# EAGLE design ardio_st32f205 (EAGLE 5.11)

## Sheet 1 of 3
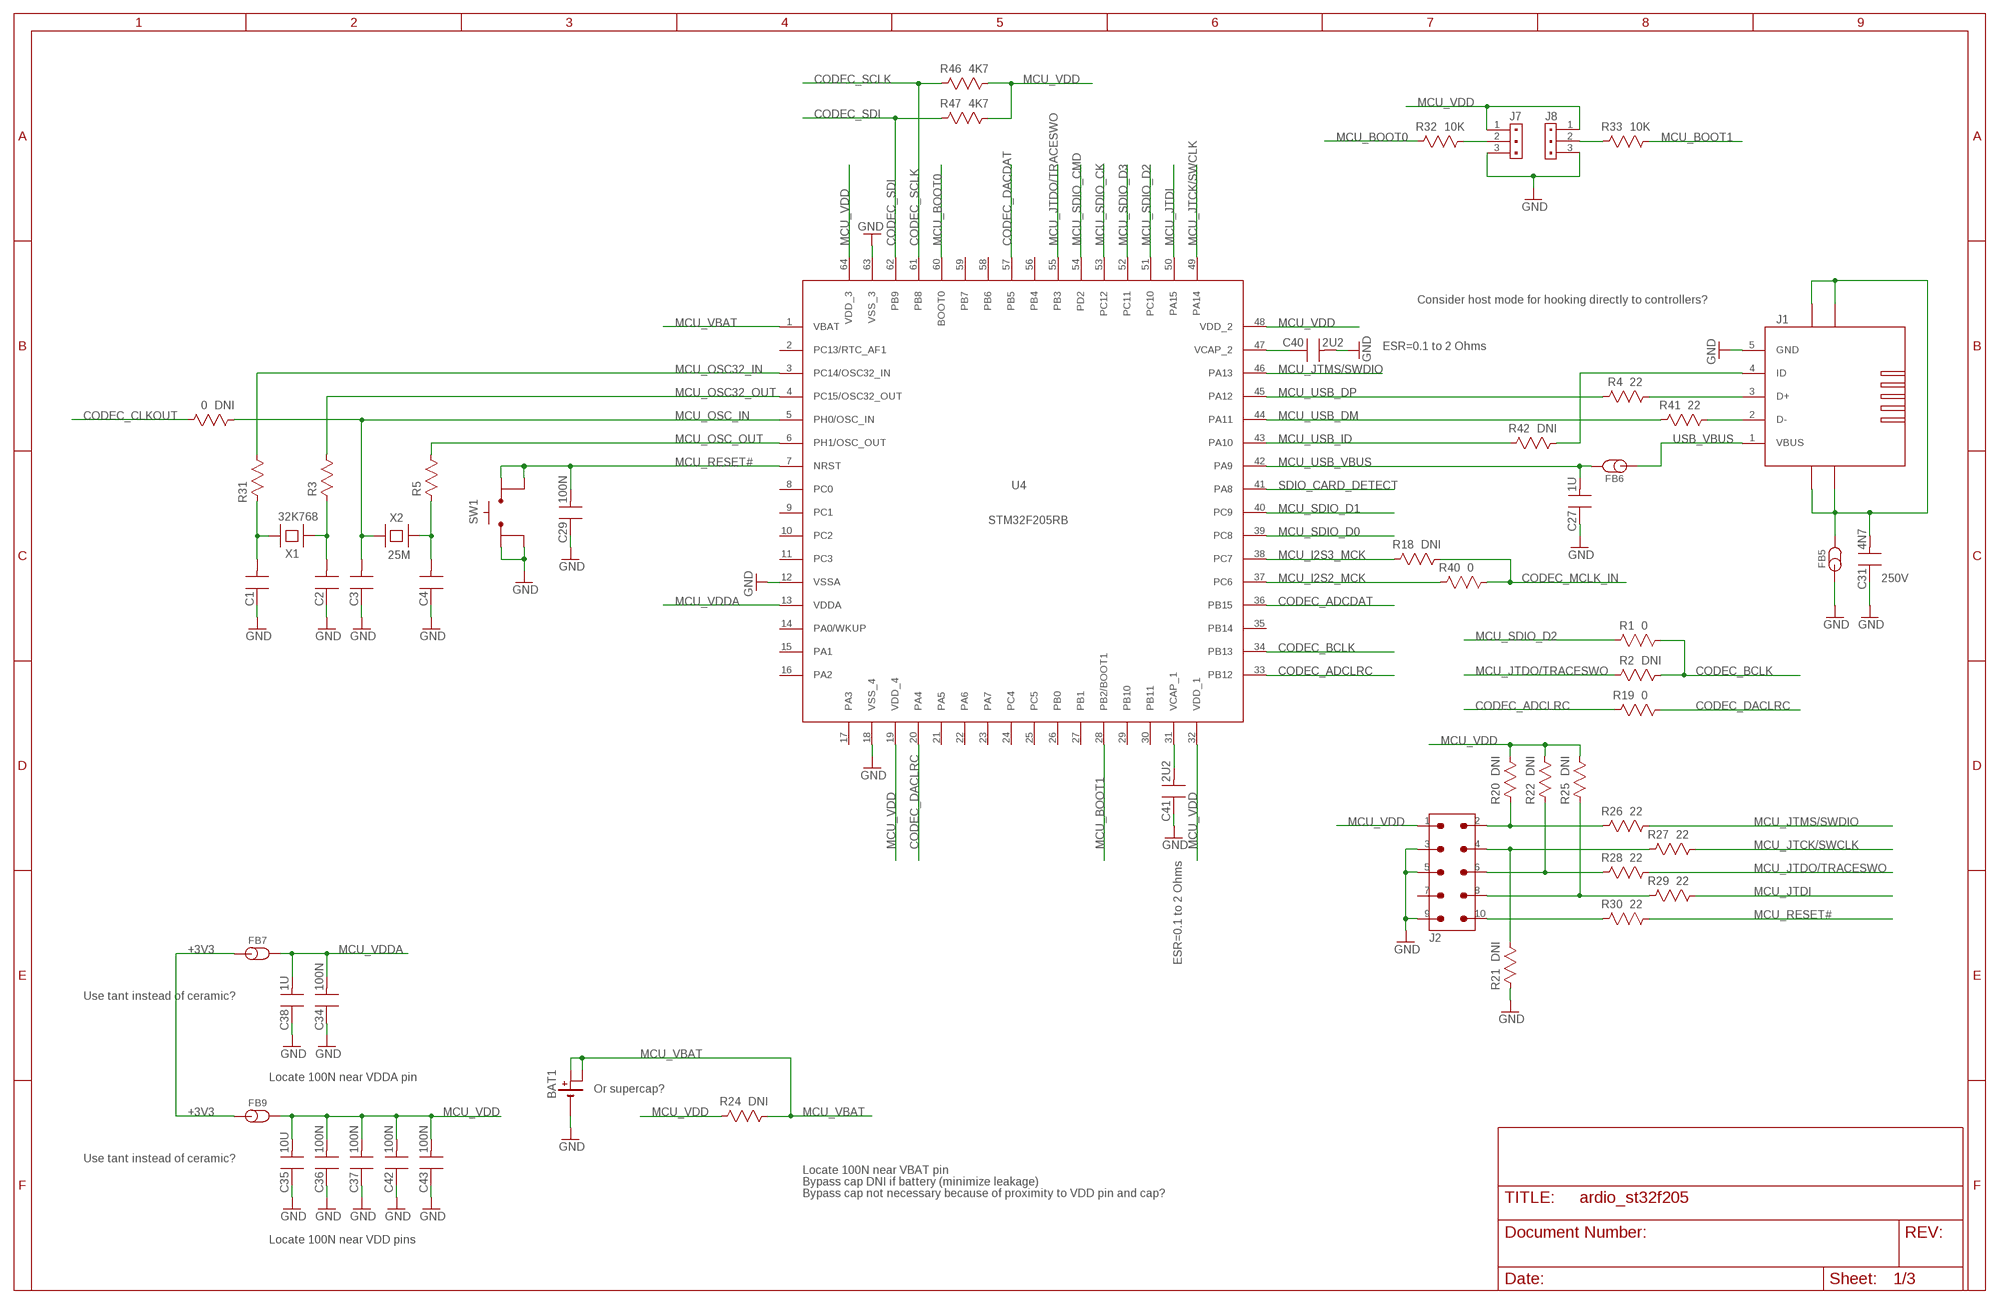
[diagram p0: schematic, sheet 1]

### Parts
0  DNI  R0603_55  [RESC1608X55N]
BAT1  BAT_3000  [3000]
C1  C0603_90  [CAPC1608X90N]
C2  C0603_90  [CAPC1608X90N]
C3  C0603_90  [CAPC1608X90N]
C4  C0603_90  [CAPC1608X90N]
C27  1U  C0603_90  [CAPC1608X90N]
C29  100N  C0603_90  [CAPC1608X90N]
C31  4N7  C0603_90  [CAPC1608X90N]
C34  100N  C0603_90  [CAPC1608X90N]
C35  10U  C0805_135  [CAPC2012X135N]
C36  100N  C0603_90  [CAPC1608X90N]
C37  100N  C0603_90  [CAPC1608X90N]
C38  1U  C0603_90  [CAPC1608X90N]
C40  2U2  C0805_135  [CAPC2012X135N]
C41  2U2  C0805_135  [CAPC2012X135N]
C42  100N  C0603_90  [CAPC1608X90N]
C43  100N  C0603_90  [CAPC1608X90N]
FB5  FB0603  [INDC1608X95N]
FB6  FB0603  [INDC1608X95N]
FB7  FB0603  [INDC1608X95N]
FB9  FB0603  [INDC1608X95N]
J1  USB_MINI_B_HIROSE_UX60_MB_5ST  [HIROSE_UX60_MB_5ST]
J2  CON2X5_2MM_SMD  CON2X5_50MIL_SMD  [SAMTEC_FTSH_DV_10]
J7  HEADER1X3TH-254  [HEADER254P1X3]
J8  HEADER1X3TH-254  [HEADER254P1X3]
R1  0  R0603_55  [RESC1608X55N]
R2  DNI  R0603_55  [RESC1608X55N]
R3  R0603_55  [RESC1608X55N]
R4  22  R0603_55  [RESC1608X55N]
R5  R0603_55  [RESC1608X55N]
R18  DNI  R0603_55  [RESC1608X55N]
R19  0  R0603_55  [RESC1608X55N]
R20  DNI  R0603_55  [RESC1608X55N]
R21  DNI  R0603_55  [RESC1608X55N]
R22  DNI  R0603_55  [RESC1608X55N]
R24  DNI  R0603_55  [RESC1608X55N]
R25  DNI  R0603_55  [RESC1608X55N]
R26  22  R0603_55  [RESC1608X55N]
R27  22  R0603_55  [RESC1608X55N]
R28  22  R0603_55  [RESC1608X55N]
R29  22  R0603_55  [RESC1608X55N]
R30  22  R0603_55  [RESC1608X55N]
R31  R0603_55  [RESC1608X55N]
R32  10K  R0603_55  [RESC1608X55N]
R33  10K  R0603_55  [RESC1608X55N]
R40  0  R0603_55  [RESC1608X55N]
R41  22  R0603_55  [RESC1608X55N]
R42  DNI  R0603_55  [RESC1608X55N]
R46  4K7  R0603_55  [RESC1608X55N]
R47  4K7  R0603_55  [RESC1608X55N]
SW1  SPST_NO_4PIN  [6X6_SMD]
U4  STM32F205RB  [QFP50P1200X1200X160-64N]
X1  32K768  X_TC38H  [TC38H]
X2  25M  X_HC49US  [HC-49/U-S]

### Nets
+3V3: FB7.1 FB9.1 ; also sheet 2,3
CODEC_ADCDAT: U4.36(PB15) ; also sheet 2
CODEC_ADCLRC: R19.1 U4.33(PB12) ; also sheet 2
CODEC_BCLK: R1.2 R2.2 U4.34(PB13) ; also sheet 2
CODEC_CLKOUT: 0.1 ; also sheet 2
CODEC_DACDAT: U4.57(PB5) ; also sheet 2
CODEC_DACLRC: R19.2 U4.20(PA4) ; also sheet 2
CODEC_MCLK_IN: R18.2 R40.2 ; also sheet 2
CODEC_SCLK: R46.1 U4.61(PB8) ; also sheet 2
CODEC_SDI: R47.1 U4.62(PB9) ; also sheet 2
GND: BAT1.NEG(-) C1.1 C2.1 C3.1 C4.1 C27.1 C29.1 C31.1 C34.1 C35.1 C36.1 C37.1 C38.1 C40.2 C41.1 C42.1 C43.1 FB5.1 J1.5(GND) J2.3 J2.5 J2.9 J7.3 J8.3 R21.1 SW1.1 SW1.2 U4.12(VSSA) U4.18(VSS_4) U4.63(VSS_3) ; also sheet 2,3
MCU_BOOT0: R32.1 U4.60(BOOT0)
MCU_BOOT1: R33.2 U4.28(PB2/BOOT1)
MCU_I2S2_MCK: R40.1 U4.37(PC6)
MCU_I2S3_MCK: R18.1 U4.38(PC7)
MCU_JTCK/SWCLK: R27.2 U4.49(PA14)
MCU_JTDI: R29.2 U4.50(PA15)
MCU_JTDO/TRACESWO: R2.1 R28.2 U4.55(PB3)
MCU_JTMS/SWDIO: R26.2 U4.46(PA13)
MCU_OSC32_IN: R31.2 U4.3(PC14/OSC32_IN)
MCU_OSC32_OUT: R3.2 U4.4(PC15/OSC32_OUT)
MCU_OSC_IN: 0.2 C3.2 U4.5(PH0/OSC_IN) X2.1
MCU_OSC_OUT: R5.2 U4.6(PH1/OSC_OUT)
MCU_RESET#: C29.2 R30.2 SW1.3 SW1.4 U4.7(NRST)
MCU_SDIO_CK: U4.53(PC12) ; also sheet 3
MCU_SDIO_CMD: U4.54(PD2) ; also sheet 3
MCU_SDIO_D0: U4.39(PC8) ; also sheet 3
MCU_SDIO_D1: U4.40(PC9) ; also sheet 3
MCU_SDIO_D2: R1.1 U4.51(PC10) ; also sheet 3
MCU_SDIO_D3: U4.52(PC11) ; also sheet 3
MCU_USB_DM: R41.1 U4.44(PA11)
MCU_USB_DP: R4.1 U4.45(PA12)
MCU_USB_ID: R42.1 U4.43(PA10)
MCU_USB_VBUS: C27.2 FB6.2 U4.42(PA9)
MCU_VBAT: BAT1.POS@1(+) BAT1.POS@2(+1) R24.2 U4.1(VBAT)
MCU_VDD: C35.2 C36.2 C37.2 C42.2 C43.2 FB9.2 J2.1 J7.1 J8.1 R20.2 R22.2 R24.1 R25.2 R46.2 R47.2 U4.19(VDD_4) U4.32(VDD_1) U4.48(VDD_2) U4.64(VDD_3) ; also sheet 3
MCU_VDDA: C34.2 C38.2 FB7.2 U4.13(VDDA)
N$1: C2.2 R3.1 X1.1
N$2: J2.8 R25.1 R29.1
N$3: J2.6 R22.1 R28.1
N$4: J2.4 R21.2 R27.1
N$5: J2.2 R20.1 R26.1
N$6: J1.3(D+) R4.2
N$7: C1.2 R31.1 X1.2
N$8: J2.10 R30.1
N$9: J7.2 R32.2
N$10: C4.2 R5.1 X2.2
N$11: J1.2(D-) R41.2
N$14: J8.2 R33.1
N$16: C40.1 U4.47(VCAP_2)
N$23: C41.2 U4.31(VCAP_1)
SDIO_CARD_DETECT: U4.41(PA8) ; also sheet 3
USB_ID: J1.4(ID) R42.2
USB_SHIELD: C31.2 FB5.2 J1.SHIELD@1(SHIELD) J1.SHIELD@2(SHIELD) J1.SHIELD@3(SHIELD) J1.SHIELD@4(SHIELD)
USB_VBUS: FB6.1 J1.1(VBUS) ; also sheet 3
Unconnected: J2.7 U4.2(PC13/RTC_AF1) U4.8(PC0) U4.9(PC1) U4.10(PC2) U4.11(PC3) U4.14(PA0/WKUP) U4.15(PA1) U4.16(PA2) U4.17(PA3) U4.21(PA5) U4.22(PA6) U4.23(PA7) U4.24(PC4) U4.25(PC5) U4.26(PB0) U4.27(PB1) U4.29(PB10) U4.30(PB11) U4.35(PB14) U4.56(PB4) U4.58(PB6) U4.59(PB7)

### Notes on the sheet
- Consider host mode for hooking directly to controllers?
- ESR=0.1 to 2 Ohms
- 250V
- ESR=0.1 to 2 Ohms
- Use tant instead of ceramic?
- Locate 100N near VDDA pin
- Or supercap?
- Use tant instead of ceramic?
- Locate 100N near VBAT pin
- Bypass cap DNI if battery (minimize leakage)
- Bypass cap not necessary because of proximity to VDD pin and cap?
- Locate 100N near VDD pins

## Sheet 2 of 3
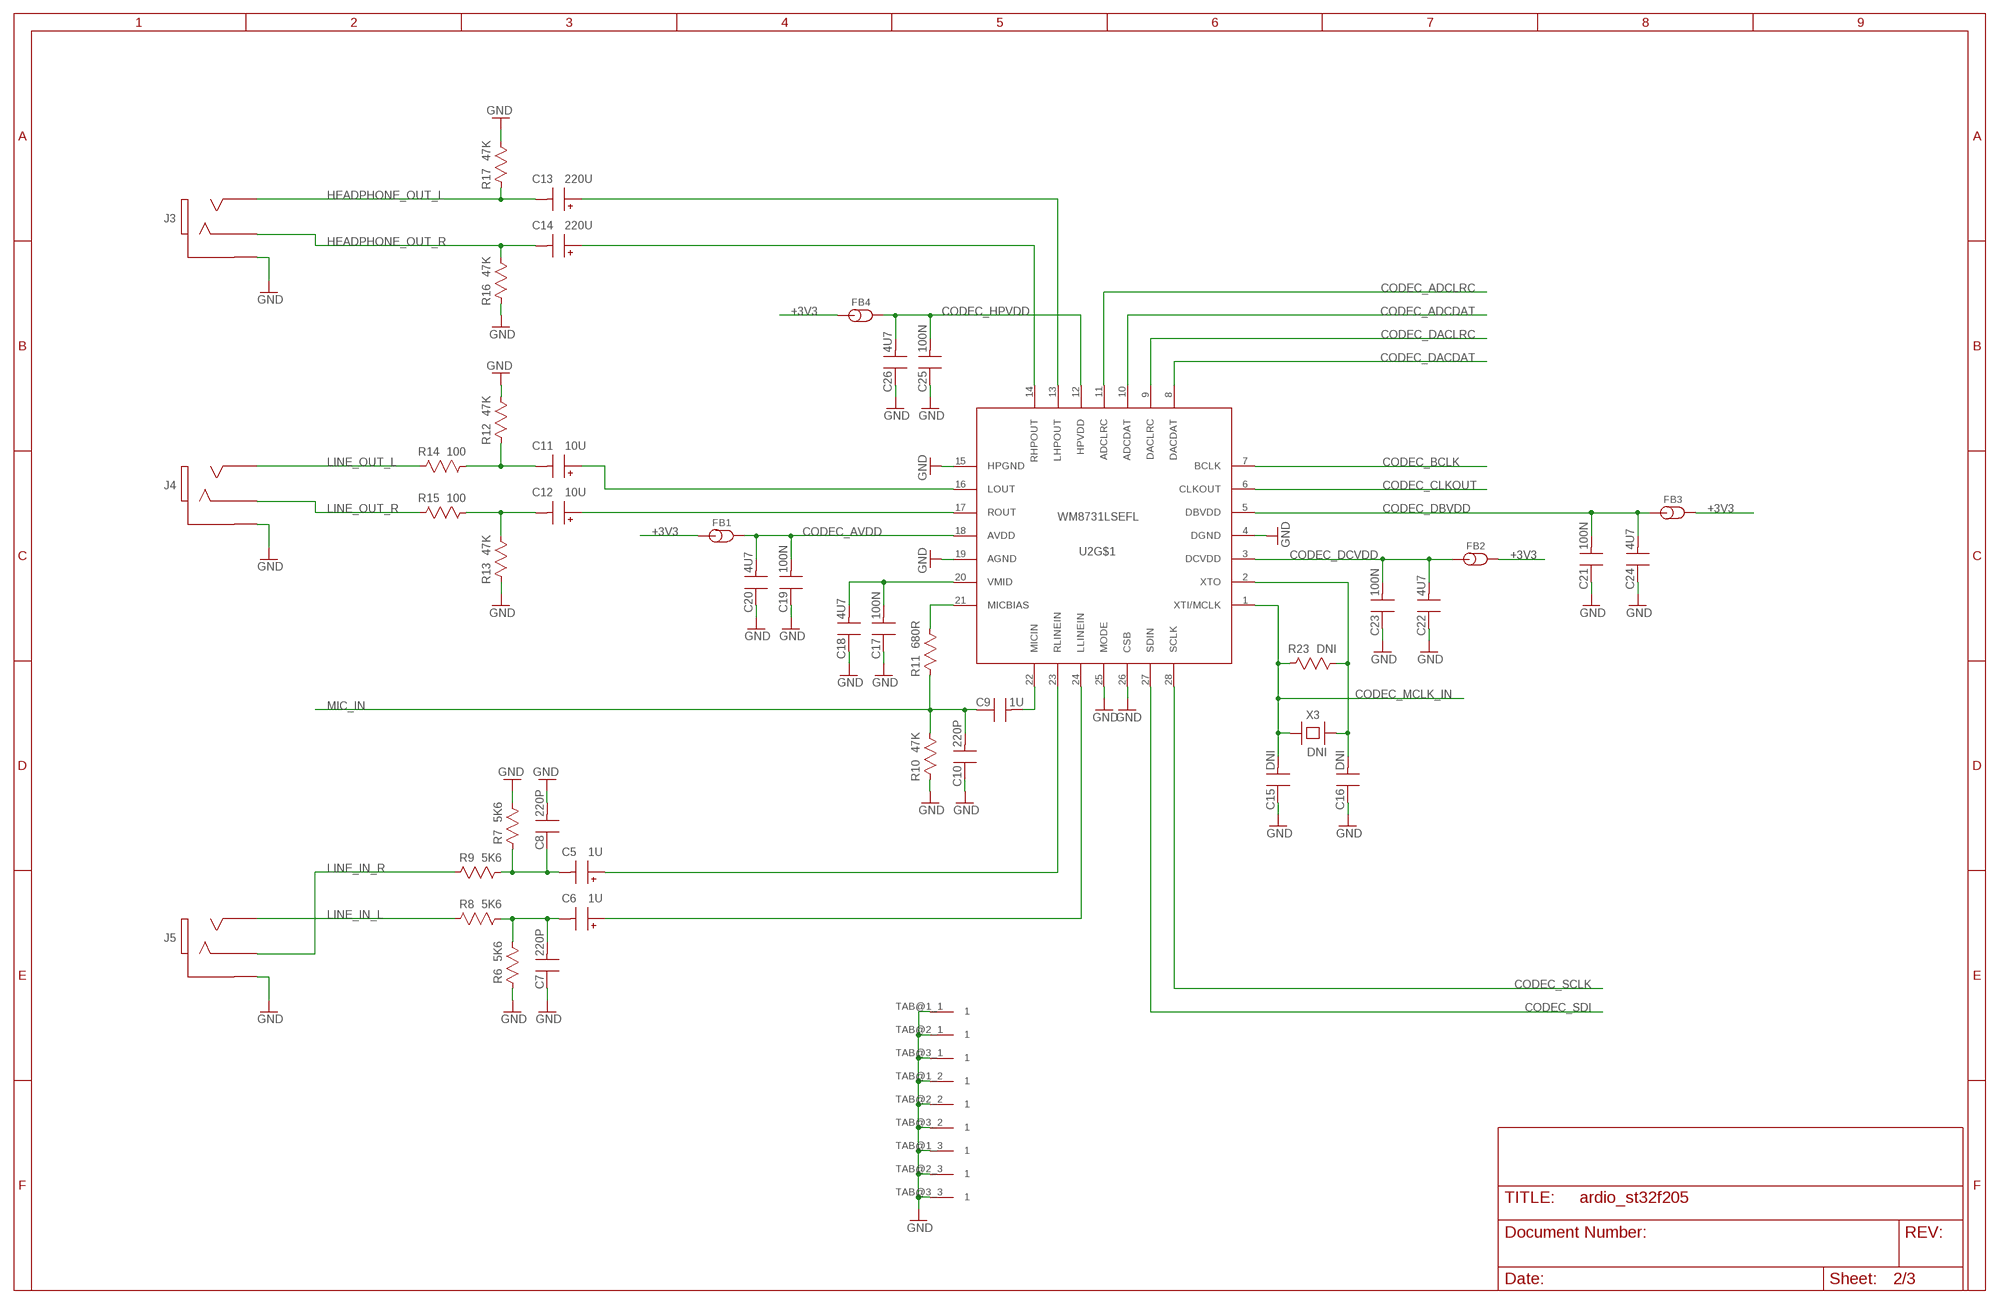
[diagram p1: schematic, sheet 2]

### Parts
C5  1U  CPOL_CASE_B  [CAPAE430X540N]
C6  1U  CPOL_CASE_B  [CAPAE430X540N]
C7  220P  C0603_90  [CAPC1608X90N]
C8  220P  C0603_90  [CAPC1608X90N]
C9  1U  C0805_135  [CAPC2012X135N]
C10  220P  C0603_90  [CAPC1608X90N]
C11  10U  CPOL_CASE_C  [CAPAE530X540N]
C12  10U  CPOL_CASE_C  [CAPAE530X540N]
C13  220U  CPOL_CASE_E  [CAPAE830X620N]
C14  220U  CPOL_CASE_E  [CAPAE830X620N]
C15  DNI  C0603_90  [CAPC1608X90N]
C16  DNI  C0603_90  [CAPC1608X90N]
C17  100N  C0603_90  [CAPC1608X90N]
C18  4U7  C0603_90  [CAPC1608X90N]
C19  100N  C0603_90  [CAPC1608X90N]
C20  4U7  C0603_90  [CAPC1608X90N]
C21  100N  C0603_90  [CAPC1608X90N]
C22  4U7  C0603_90  [CAPC1608X90N]
C23  100N  C0603_90  [CAPC1608X90N]
C24  4U7  C0603_90  [CAPC1608X90N]
C25  100N  C0603_90  [CAPC1608X90N]
C26  4U7  C0603_90  [CAPC1608X90N]
FB1  FB0603  [INDC1608X95N]
FB2  FB0603  [INDC1608X95N]
FB3  FB0603  [INDC1608X95N]
FB4  FB0603  [INDC1608X95N]
J3  STEREO_JACK_CUI_SJ_3523_SMT  [CUI_SJ-3523-SMT]
J4  STEREO_JACK_CUI_SJ_3523_SMT  [CUI_SJ-3523-SMT]
J5  STEREO_JACK_CUI_SJ_3523_SMT  [CUI_SJ-3523-SMT]
R6  5K6  R0603_55  [RESC1608X55N]
R7  5K6  R0603_55  [RESC1608X55N]
R8  5K6  R0603_55  [RESC1608X55N]
R9  5K6  R0603_55  [RESC1608X55N]
R10  47K  R0603_55  [RESC1608X55N]
R11  680R  R0603_55  [RESC1608X55N]
R12  47K  R0603_55  [RESC1608X55N]
R13  47K  R0603_55  [RESC1608X55N]
R14  100  R0603_55  [RESC1608X55N]
R15  100  R0603_55  [RESC1608X55N]
R16  47K  R0603_55  [RESC1608X55N]
R17  47K  R0603_55  [RESC1608X55N]
R23  DNI  R0603_55  [RESC1608X55N]
U2  WM8731LSEFL  [FL28]
X3  DNI  X_HC49US  [HC-49/U-S]

### Nets
+3V3: FB1.1 FB2.2 FB3.2 FB4.1 ; also sheet 1,3
CODEC_ADCDAT: U2.10(ADCDAT) ; also sheet 1
CODEC_ADCLRC: U2.11(ADCLRC) ; also sheet 1
CODEC_AVDD: C19.2 C20.2 FB1.2 U2.18(AVDD)
CODEC_BCLK: U2.7(BCLK) ; also sheet 1
CODEC_CLKOUT: U2.6(CLKOUT) ; also sheet 1
CODEC_DACDAT: U2.8(DACDAT) ; also sheet 1
CODEC_DACLRC: U2.9(DACLRC) ; also sheet 1
CODEC_DBVDD: C21.2 C24.2 FB3.1 U2.5(DBVDD)
CODEC_DCVDD: C22.2 C23.2 FB2.1 U2.3(DCVDD)
CODEC_HPVDD: C25.2 C26.2 FB4.2 U2.12(HPVDD)
CODEC_MCLK_IN: C15.2 R23.1 U2.1(XTI/MCLK) X3.1 ; also sheet 1
CODEC_SCLK: U2.28(SCLK) ; also sheet 1
CODEC_SDI: U2.27(SDIN) ; also sheet 1
GND: C7.1 C8.2 C10.1 C15.1 C16.1 C17.1 C18.1 C19.1 C20.1 C21.1 C22.1 C23.1 C24.1 C25.1 C26.1 J3.1 J4.1 J5.1 R6.1 R7.2 R10.1 R12.2 R13.1 R16.1 R17.2 U2.4(DGND) U2.15(HPGND) U2.19(AGND) U2.25(MODE) U2.26(CSB) U2.TAB@1_1 U2.TAB@1_2 U2.TAB@1_3 U2.TAB@2_1 U2.TAB@2_2 U2.TAB@2_3 U2.TAB@3_1 U2.TAB@3_2 U2.TAB@3_3 ; also sheet 1,3
HEADPHONE_OUT_L: C13.2 J3.2 R17.1
HEADPHONE_OUT_R: C14.2 J3.3 R16.2
LINE_IN_L: J5.2 R8.1
LINE_IN_R: J5.3 R9.1
LINE_OUT_L: J4.2 R14.1
LINE_OUT_R: J4.3 R15.1
MIC_IN: C9.1 C10.2 R10.2 R11.1
N$15: C16.2 R23.2 U2.2(XTO) X3.2
N$18: C6.1 U2.24(LLINEIN)
N$19: C5.1 U2.23(RLINEIN)
N$20: C5.2 C8.1 R7.1 R9.2
N$21: C6.2 C7.2 R6.2 R8.2
N$24: R11.2 U2.21(MICBIAS)
N$25: C9.2 U2.22(MICIN)
N$27: C11.1 U2.16(LOUT)
N$28: C12.1 U2.17(ROUT)
N$29: C11.2 R12.1 R14.2
N$30: C12.2 R13.2 R15.2
N$33: C13.1 U2.13(LHPOUT)
N$34: C14.1 U2.14(RHPOUT)
N$41: C17.2 C18.2 U2.20(VMID)

## Sheet 3 of 3
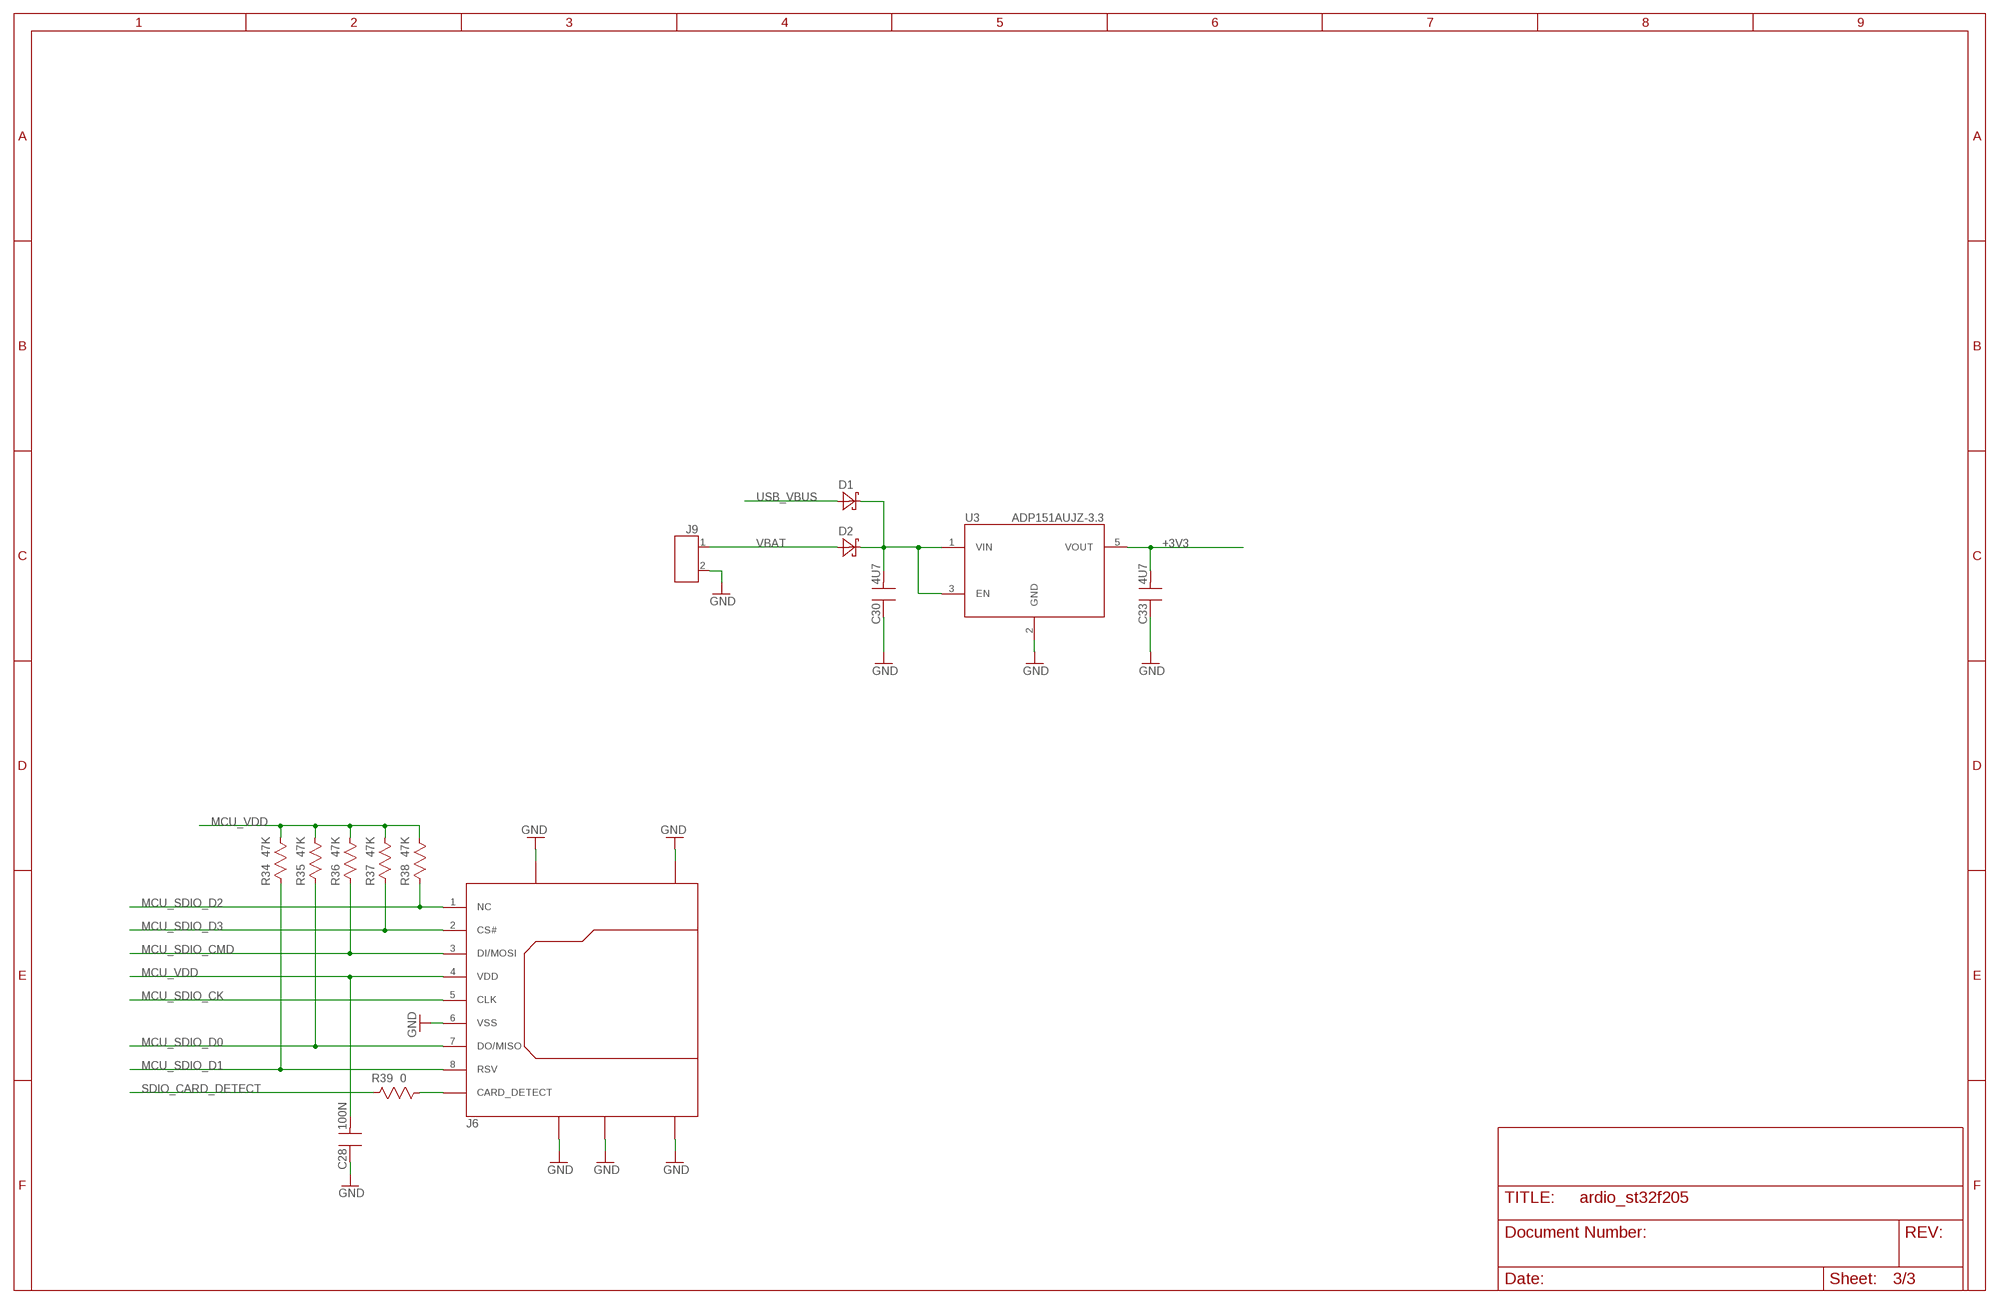
[diagram p2: schematic, sheet 3]

### Parts
C28  100N  C0603_90  [CAPC1608X90N]
C30  4U7  C0603_90  [CAPC1608X90N]
C33  4U7  C0603_90  [CAPC1608X90N]
D1  SCHOTTKY_SMA  [DIOM5027X244N]
D2  SCHOTTKY_SMA  [DIOM5027X244N]
J6  MICROSD_SPI_DM3AT  [DM3AT]
J9  CON2_100MIL  [STAKE_100MIL_2]
R34  47K  R0603_55  [RESC1608X55N]
R35  47K  R0603_55  [RESC1608X55N]
R36  47K  R0603_55  [RESC1608X55N]
R37  47K  R0603_55  [RESC1608X55N]
R38  47K  R0603_55  [RESC1608X55N]
R39  0  R0603_55  [RESC1608X55N]
U3  ADP151AUJZ-3.3  [SOT95P280X110-5N]

### Nets
+3V3: C33.2 U3.5(VOUT) ; also sheet 1,2
GND: C28.1 C30.1 C33.1 J6.6(VSS) J6.SHIELD@1(SHIELD) J6.SHIELD@2(SHIELD) J6.SHIELD@3(SHIELD) J6.SHIELD@4(SHIELD) J6.SHIELD@5(SHIELD) J9.2 U3.2(GND) ; also sheet 1,2
MCU_SDIO_CK: J6.5(CLK) ; also sheet 1
MCU_SDIO_CMD: J6.3(DI/MOSI) R36.1 ; also sheet 1
MCU_SDIO_D0: J6.7(DO/MISO) R35.1 ; also sheet 1
MCU_SDIO_D1: J6.8(RSV) R34.1 ; also sheet 1
MCU_SDIO_D2: J6.1(NC) R38.1 ; also sheet 1
MCU_SDIO_D3: J6.2(CS#) R37.1 ; also sheet 1
MCU_VDD: C28.2 J6.4(VDD) R34.2 R35.2 R36.2 R37.2 R38.2 ; also sheet 1
N$22: J6.CARD_DETECT R39.2
SDIO_CARD_DETECT: R39.1 ; also sheet 1
USB_VBUS: D1.A ; also sheet 1
V+: C30.2 D1.C D2.C U3.1(VIN) U3.3(EN)
VBAT: D2.A J9.1

## Library data of the parts
0 R1-R42 R46 R47 = resistor:R
BAT1 = keystone:BAT
C1-C4 C7-C10 C15-C31 C33-C38 C40-C43 = capacitor:C
C5 C6 C11-C14 = capacitor:CPOL
D1 D2 = diode:SCHOTTKY
FB1-FB7 FB9 = inductor:FB
J1 = usb:USB_MINI_B
J2 = samtec:CON2X5
J3-J5 = audio_connector:STEREO_JACK
J6 = hirose:MICROSD_SPI
J7 J8 = stake:HEADER1X3
J9 = stake:CON2
SW1 = switch:SPST_NO_4PIN
U2 = wolfson:WM8731*SE?
U3 = analog_devices:ADP151A?-*
U4 = st:STM32F205?*
X1-X3 = crystal:X

## Board
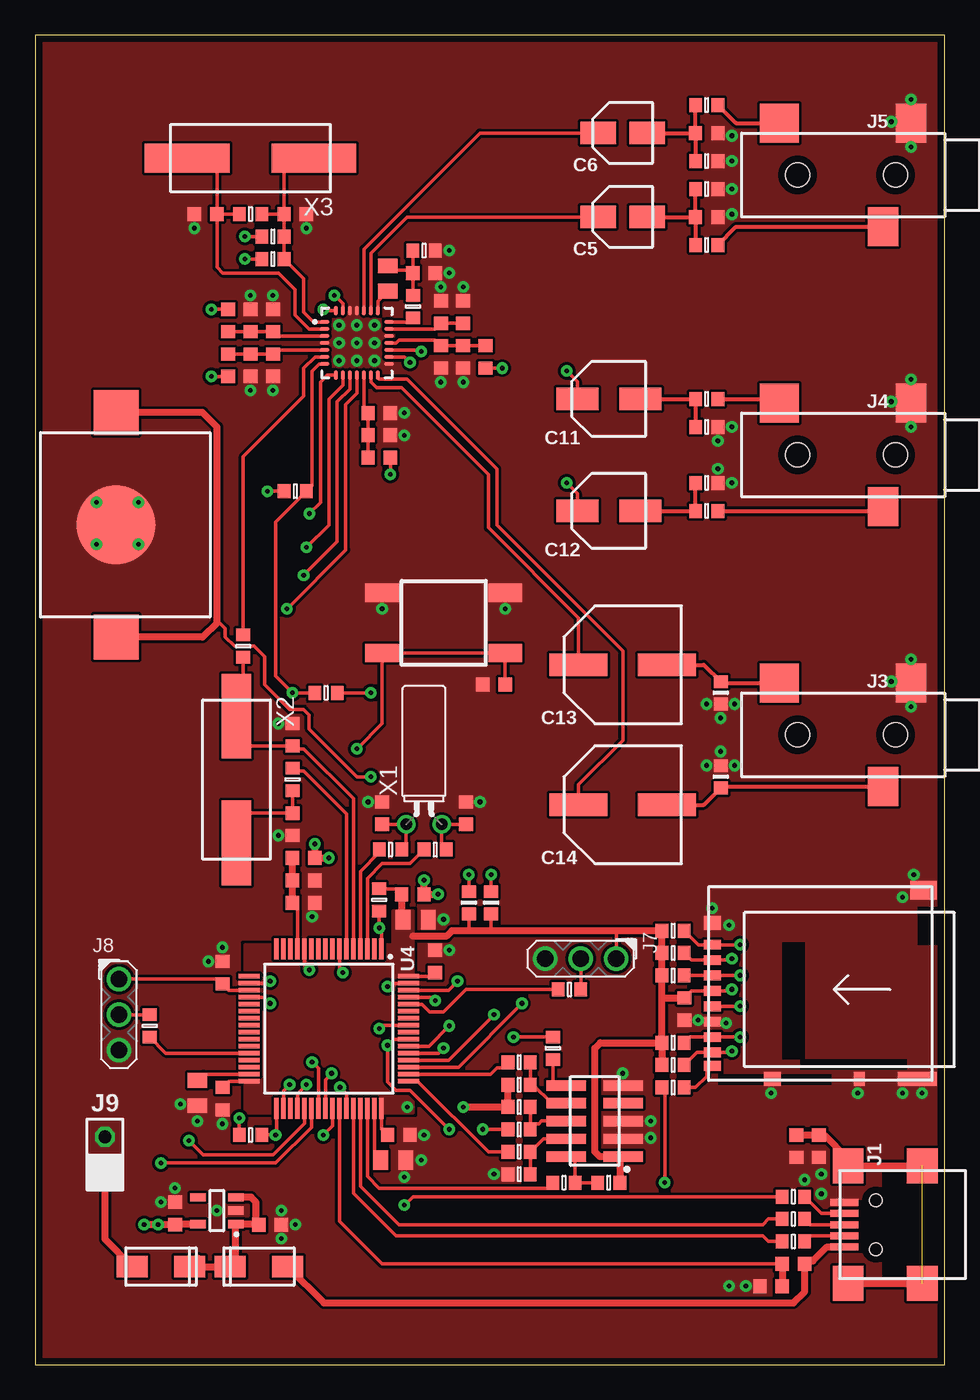
[diagram p3: board, top side]
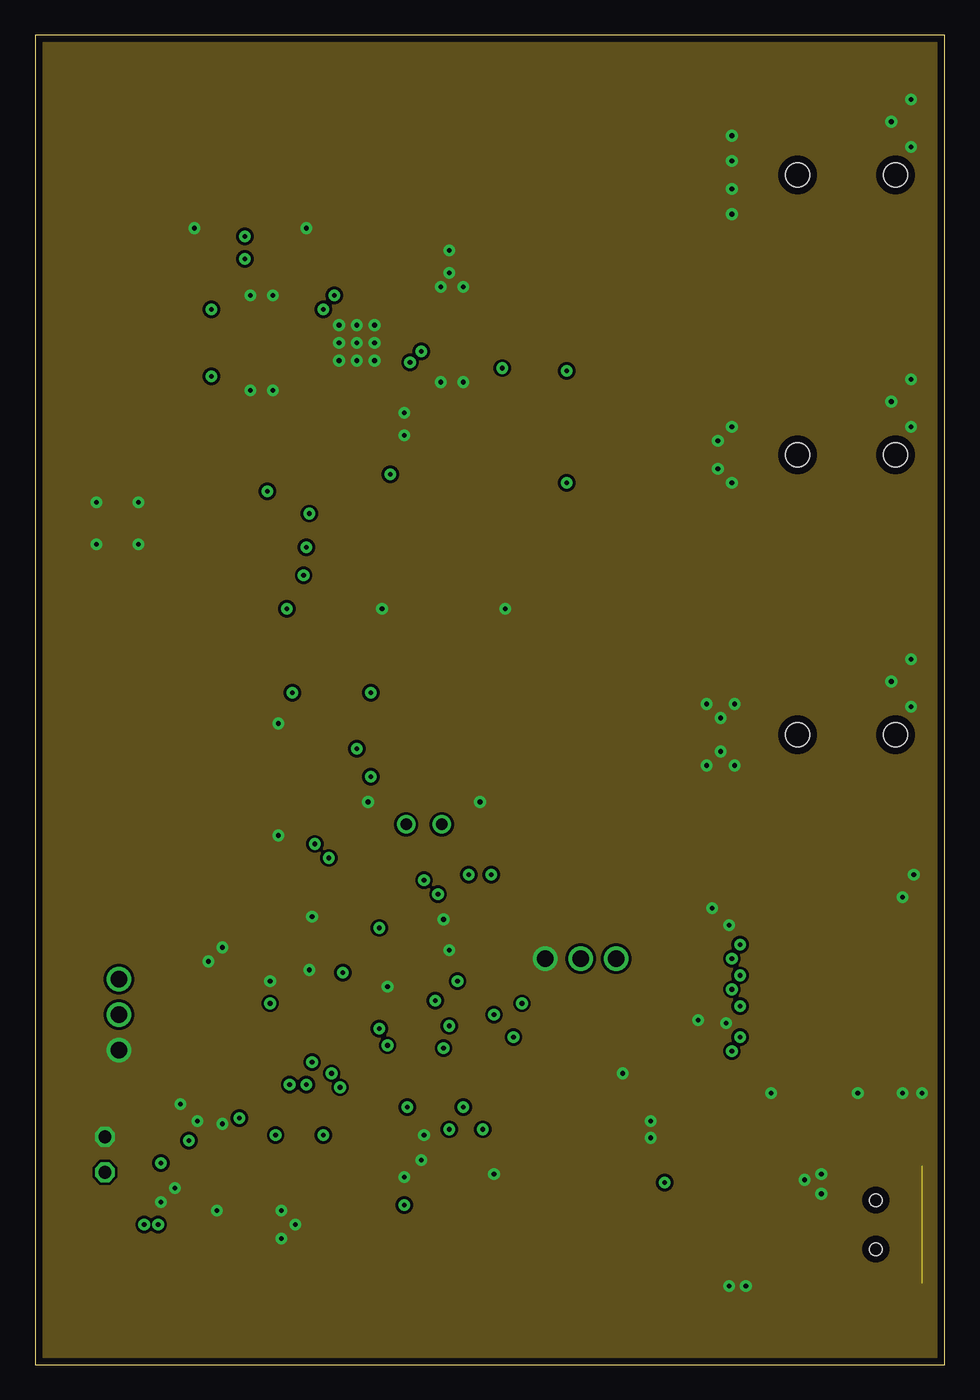
[diagram p4: board, inner layer Route2]
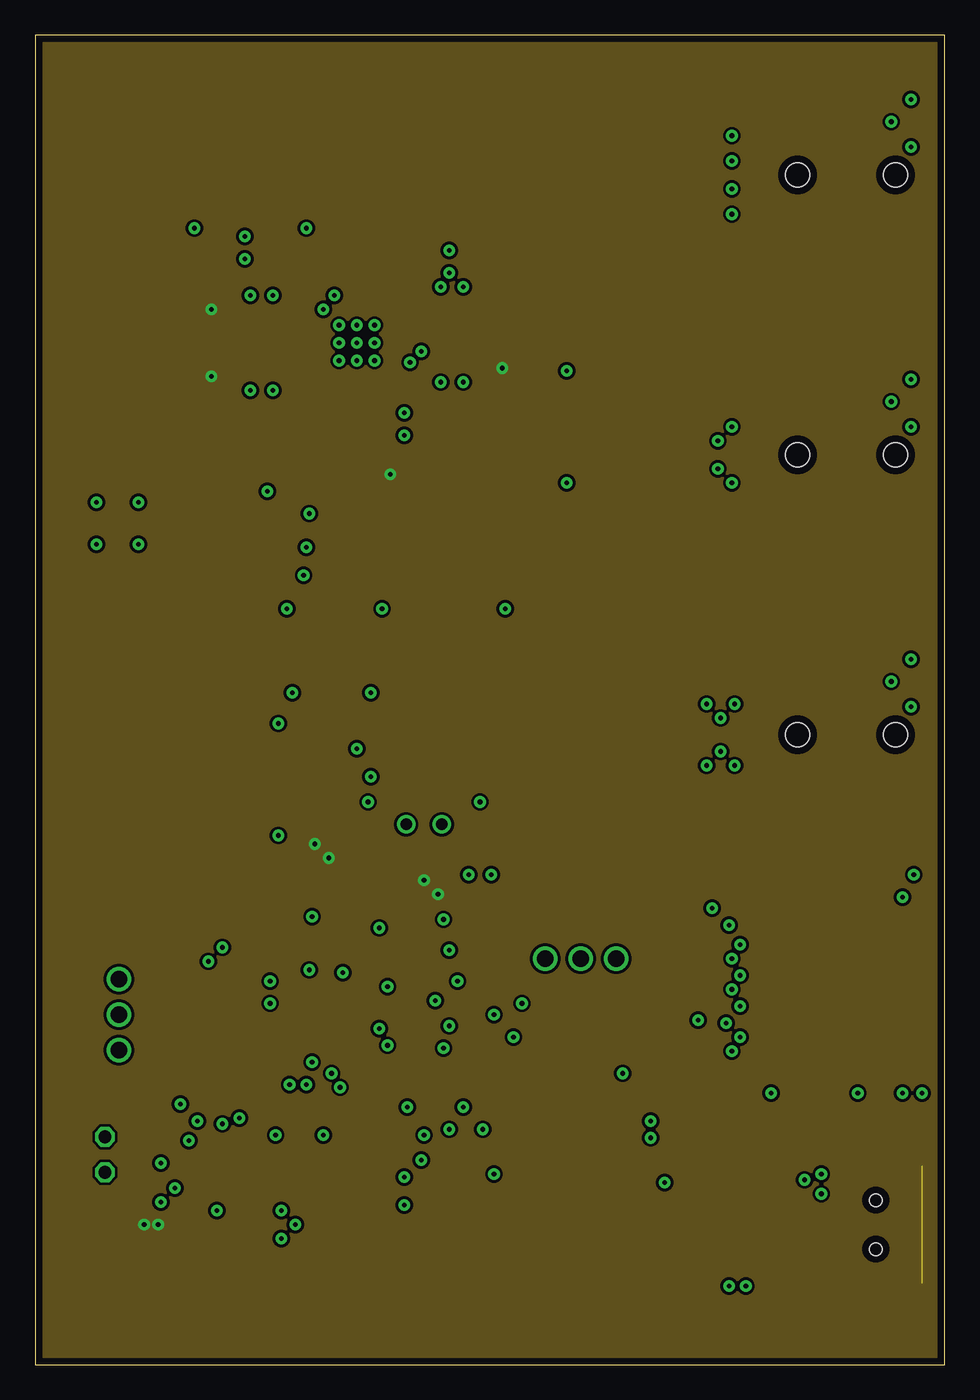
[diagram p5: board, inner layer Route15]
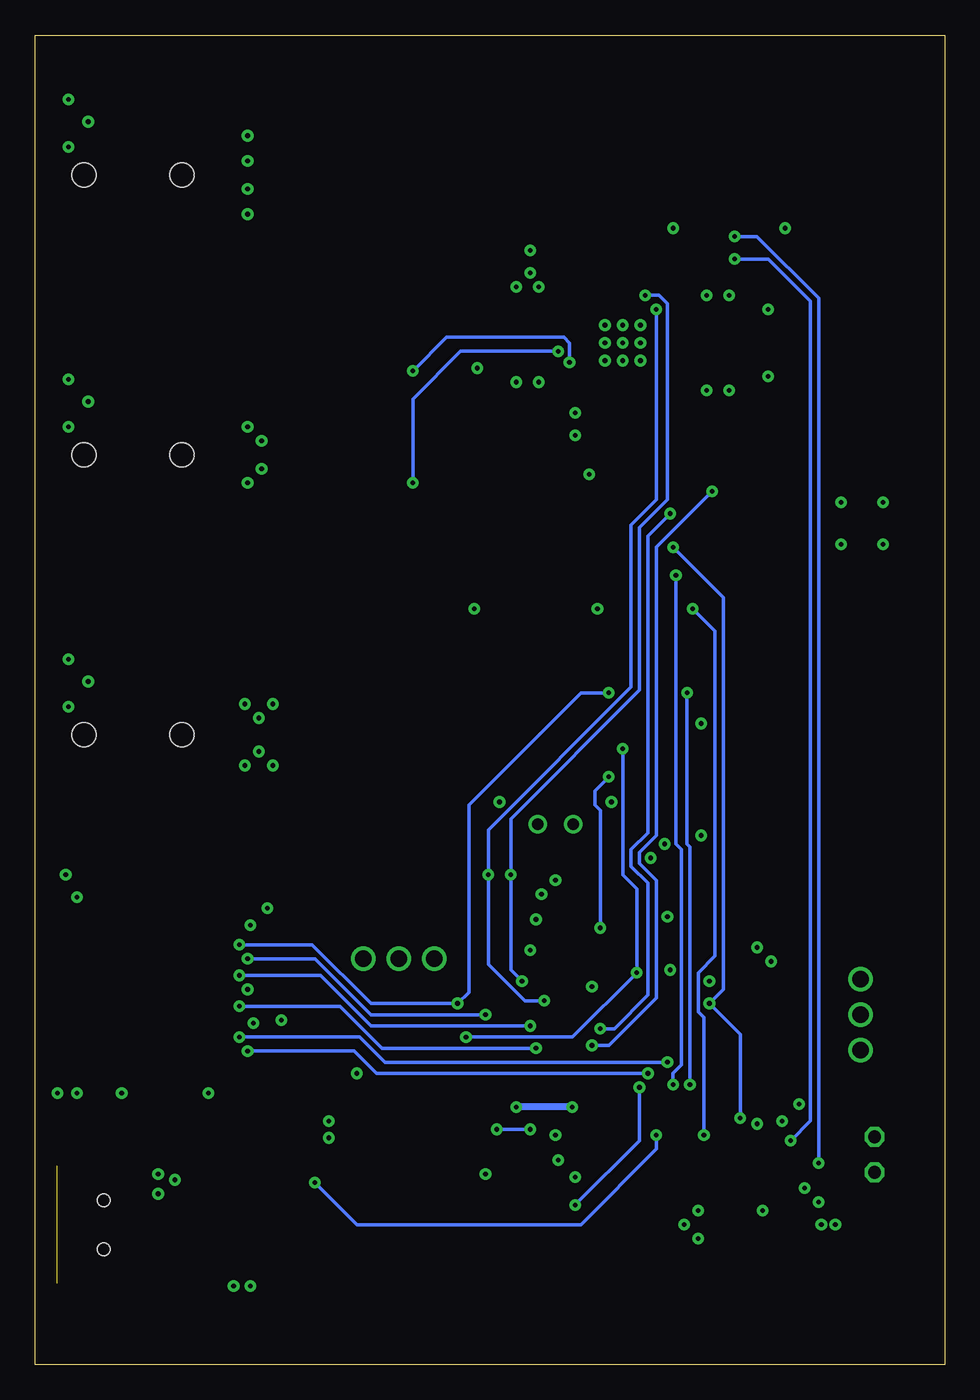
[diagram p6: board, bottom side, seen from below]

Size 65 x 95 mm. Coordinates in mm from the lower left corner, seen from the top.
Outline: 0,0 65,0 65,95 0,95 0,0
Copper layers (1+2*15+16): Top 0.0178mm / dielectric 0.3048mm / Route2 0.0356mm / dielectric 0.7112mm / Route15 0.0356mm / dielectric 0.3048mm / Bottom 0.0178mm
Design rules "ardio_st32f205 *": minimum track width 0.25mm, minimum drill 13mil, track to track 0.2mm, track to pad 0.2mm, pad to pad 0.2mm, via to via 0.2mm, smd to smd 0.2mm, copper to edge 20mil, drill to drill 16mil, minimum pad ring 10mil, minimum via ring 10mil, stop-mask expansion 3mil, vias tented up to drill 13mil, thermal gap 8mil
tRestrict: area 53,6.6 to 55.5,12.5

### Footprints (pad centres in the part's own frame; a part is rotated, then mirrored left to right if it is on the bottom)
RESC1608X55N = smd 0.9 x 1: 1 -0.8,0; 2 0.8,0
3000 = smd 5.66 x 5.66: NEG 0,0 | smd 3.2 x 3.2: POS@1 -8.025,0; POS@2 8.025,0
CAPC1608X90N = smd 0.95 x 1: 1 -0.8,0; 2 0.8,0
CAPAE430X540N = smd 2.55 x 1.6: 1 -1.75,0; 2 1.75,0
CAPC2012X135N = smd 1.05 x 1.4: 1 -0.9,0; 2 0.9,0
CAPAE530X540N = smd 3 x 1.6: 1 -2.25,0; 2 2.25,0
CAPAE830X620N = smd 4.15 x 1.6: 1 -3.15,0; 2 3.15,0
DIOM5027X244N = smd 2.2 x 1.55: A 2.05,0; C -2.05,0
INDC1608X95N = smd 0.95 x 1: 1 -0.8,0; 2 0.8,0
HIROSE_UX60_MB_5ST = smd 0.5 x 2: 1 -1.6,4.15; 2 -0.8,4.15; 3 0,4.15; 4 0.8,4.15; 5 1.6,4.15 | smd 2.5 x 2.2: SHIELD@1 -4.2,-1.4; SHIELD@2 -4.2,3.9; SHIELD@3 4.2,-1.4; SHIELD@4 4.2,3.9 | hole 0.9: -1.75,1.9; 1.75,1.9
SAMTEC_FTSH_DV_10 = smd 2.8 x 0.74: 1 -2.03,2.54; 2 2.03,2.54; 3 -2.03,1.27; 4 2.03,1.27; 5 -2.03,0; 6 2.03,0; 7 -2.03,-1.27; 8 2.03,-1.27; 9 -2.03,-2.54; 10 2.03,-2.54
CUI_SJ-3523-SMT = smd 2.2 x 2.8: 1 -3.6,-3.7; 3 -1.6,3.7 | smd 2.8 x 2.8: 2 5.8,-3.7 | hole 1.7: -2.5,0; 4.5,0
DM3AT = smd 0.7 x 1.2: 1 0,0.6; 2 -1.1,0.6; 3 -2.2,0.6; 4 -3.3,0.6; 5 -4.4,0.6; 6 -5.5,0.6; 7 -6.6,0.6; 8 -7.7,0.6; CARD_DETECT -8.65,0.6 | smd 1 x 2.8: SHIELD@1 -9.6,-14.05 | smd 1 x 0.8: SHIELD@2 -9.6,-9.9 | smd 1 x 1.2: SHIELD@3 -9.6,-3.7; SHIELD@4 1.55,0.6 | smd 1.3 x 1.9: SHIELD@5 3.9,-14.5
HEADER254P1X3 = drill 1.168 round: 1 0,2.54; 2 0,0; 3 0,-2.54
STAKE_100MIL_2 = drill 0.914 octagon: 1 -1.27,0; 2 1.27,0
6X6_SMD = smd 2.4 x 1.3: 1 -4.4,2.15; 2 4.4,2.15; 3 -4.4,-2.15; 4 4.4,-2.15
FL28 = smd 0.69 x 0.26: 1 -2.315,1.5; 2 -2.315,1; 3 -2.315,0.5; 4 -2.315,0; 5 -2.315,-0.5; 6 -2.315,-1; 7 -2.315,-1.5; 15 2.315,-1.5; 16 2.315,-1; 17 2.315,-0.5; 18 2.315,0; 19 2.315,0.5; 20 2.315,1; 21 2.315,1.5 | smd 0.26 x 0.69: 8 -1.5,-2.315; 9 -1,-2.315; 10 -0.5,-2.315; 11 0,-2.315; 12 0.5,-2.315; 13 1,-2.315; 14 1.5,-2.315; 22 1.5,2.315; 23 1,2.315; 24 0.5,2.315; 25 0,2.315; 26 -0.5,2.315; 27 -1,2.315; 28 -1.5,2.315 | drill 0.33 round: TAB@1_1 -1.27,1.27; TAB@1_2 -1.27,0; TAB@1_3 -1.27,-1.27; TAB@2_1 0,1.27; TAB@2_2 0,0; TAB@2_3 0,-1.27; TAB@3_1 1.27,1.27; TAB@3_2 1.27,0; TAB@3_3 1.27,-1.27
SOT95P280X110-5N = smd 1.1 x 0.6: 1 -1.35,0.95; 2 -1.35,0; 3 -1.35,-0.95; 4 1.35,-0.95; 5 1.35,0.95
QFP50P1200X1200X160-64N = smd 1.5 x 0.3: 1 -5.7,3.75; 2 -5.7,3.25; 3 -5.7,2.75; 4 -5.7,2.25; 5 -5.7,1.75; 6 -5.7,1.25; 7 -5.7,0.75; 8 -5.7,0.25; 9 -5.7,-0.25; 10 -5.7,-0.75; 11 -5.7,-1.25; 12 -5.7,-1.75; 13 -5.7,-2.25; 14 -5.7,-2.75; 15 -5.7,-3.25; 16 -5.7,-3.75; 33 5.7,-3.75; 34 5.7,-3.25; 35 5.7,-2.75; 36 5.7,-2.25; 37 5.7,-1.75; 38 5.7,-1.25; 39 5.7,-0.75; 40 5.7,-0.25; 41 5.7,0.25; 42 5.7,0.75; 43 5.7,1.25; 44 5.7,1.75; 45 5.7,2.25; 46 5.7,2.75; 47 5.7,3.25; 48 5.7,3.75 | smd 0.3 x 1.5: 17 -3.75,-5.7; 18 -3.25,-5.7; 19 -2.75,-5.7; 20 -2.25,-5.7; 21 -1.75,-5.7; 22 -1.25,-5.7; 23 -0.75,-5.7; 24 -0.25,-5.7; 25 0.25,-5.7; 26 0.75,-5.7; 27 1.25,-5.7; 28 1.75,-5.7; 29 2.25,-5.7; 30 2.75,-5.7; 31 3.25,-5.7; 32 3.75,-5.7; 49 3.75,5.7; 50 3.25,5.7; 51 2.75,5.7; 52 2.25,5.7; 53 1.75,5.7; 54 1.25,5.7; 55 0.75,5.7; 56 0.25,5.7; 57 -0.25,5.7; 58 -0.75,5.7; 59 -1.25,5.7; 60 -1.75,5.7; 61 -2.25,5.7; 62 -2.75,5.7; 63 -3.25,5.7; 64 -3.75,5.7
TC38H = drill 0.813 round: 1 -1.27,0; 2 1.27,0
HC-49/U-S = smd 6.05 x 2.1: 1 -4.525,0; 2 4.525,0

### Placement (x,y rotation side)
0  14.88,51.33 270 top
BAT1  5.8,60 90 top
C1  30.8,39.4 270 top
C2  24.8,39.4 270 top
C3  18.4,45 270 top
C4  18.4,38.6 90 top
C5  42,82 0 top
C6  42,88 0 top
C7  48,88 180 top
C8  48,82 0 top
C9  25.2,77.6 270 top
C10  27.8,78 180 top
C11  41,69 0 top
C12  41,61 0 top
C13  42,50 0 top
C14  42,40 0 top
C15  18.6,82.2 180 top
C16  12.2,82.2 0 top
C17  29,75.2 270 top
C18  30.6,75.2 270 top
C19  29,72 90 top
C20  30.6,72 90 top
C21  17,71.4 90 top
C22  15.4,74.6 270 top
C23  17,74.6 270 top
C24  15.4,71.4 90 top
C25  24.6,68 180 top
C26  24.6,66.4 180 top
C27  52.6,5.6 0 top
C28  46.4,25.4 90 top
C29  32.8,48.6 0 top
C30  16.8,10 180 top
C31  54.4,15.6 90 top
C33  10,10.8 270 top
C34  19.2,33 180 top
C35  27.2,31.8 180 top
C36  13.4,28 270 top
C37  13.4,19 90 top
C38  19.2,34.6 180 top
C40  25.6,14.6 0 top
C41  11.6,19.4 90 top
C42  26,16.4 180 top
C43  28.6,28.8 270 top
D1  16,7 0 top
D2  9,7 180 top
FB1  32.2,72 90 top
FB2  13.8,74.6 90 top
FB3  13.8,71.4 270 top
FB4  24.6,64.8 180 top
FB5  56,15.6 90 top
FB6  54.2,7.2 180 top
FB7  19.2,36.2 180 top
FB9  27,33.6 180 top
J1  62,10 90 top
J2  40,17.4 180 top
J3  59,45 180 top
J4  59,65 180 top
J5  59,85 180 top
J6  49,30 90 top
J7  39,29 270 top
J8  6,25 0 top
J9  5,15 90 top
R1  20.8,48 180 top
R2  18.6,62.4 0 top
R3  25.4,36.8 180 top
R4  54.2,10.4 0 top
R5  18.4,41.8 90 top
R6  48,86 180 top
R7  48,84 0 top
R8  48,90 180 top
R9  48,80 180 top
R10  27.8,79.6 180 top
R11  27,75.6 270 top
R12  48,67 0 top
R13  48,63 180 top
R14  48,69 180 top
R15  48,61 180 top
R16  49,42 270 top
R17  49,48 270 top
R18  17,80.6 0 top
R19  15.4,16.4 180 top
R20  41,13 0 top
R21  34.6,13.6 0 top
R22  34.6,18.4 180 top
R23  15.4,82.2 180 top
R24  24.6,33.2 270 top
R25  34.6,20 180 top
R26  37.8,13 180 top
R27  34.6,15.2 180 top
R28  34.6,16.8 180 top
R29  34.6,21.6 180 top
R30  37,22.6 90 top
R31  28.6,36.8 180 top
R32  38.2,26.8 0 top
R33  8.2,24.2 270 top
R34  45.6,21.4 180 top
R35  45.6,23 180 top
R36  45.6,27.8 180 top
R37  45.6,29.4 180 top
R38  45.6,31 180 top
R39  45.6,19.8 0 top
R40  17,79 0 top
R41  54.2,8.8 0 top
R42  54.2,12 0 top
R46  32.6,33 270 top
R47  31,33 270 top
SW1  29.2,53 0 top
U2  23,73 0 top
U3  13,11 180 top
U4  21,24 270 top
X1  27.8,38.6 0 top
X2  14.4,41.8 270 top
X3  15.4,86.2 180 top

### Tracks (layer width: path | path; a pad name or v marks a point on that pad's centre or on a via)
+3V3  (via drill 0.33)
  Top 0.25: FB1.1 v33.4,71.2 | FB4.1 v25.4,63.6 | v12.6,70.6 FB3.2 | v12.6,75.4 FB2.2
  Top 0.5: v28.8,33.6 FB9.1 v27.8,34.6 | v20,37.2 FB7.1 v21,36.2 | U3.5 10.05,10.05 C33.2 v8.8,10 v7.8,10
  pour Route15 (no thermals): 0,0 0,95 65,95 65,0
CODEC_ADCDAT  (via drill 0.33)
  Top 0.25: U2.10 22.5,69.7 21.6,68.8 21.6,58.8 v19.2,56.4 | U4.36 18.75,19.35 v19.4,20
  Bottom 0.25: v19.4,20 19.4,20.8 18.8,21.4 18.8,36.8 19.2,37.2 v19.2,56.4
CODEC_ADCLRC  (via drill 0.33)
  Top 0.25: U2.11 23,69.4 22.2,68.6 22.2,58.2 v18,54 | U4.33 17.25,16.45 v17.2,16.4 R19.1
  Bottom 0.25: v17.2,16.4 17.2,24.8 17.6,25.2 17.6,28 16.4,29.2 16.4,52.4 v18,54
CODEC_AVDD
  Top 0.25: U2.18 25.8,73 26,73.2 28.6,73.2 C19.2 C20.2 FB1.2
CODEC_BCLK  (via drill 0.33)
  Top 0.25: U2.7 20.3,71.5 19.8,71 19.8,62.8 R2.2 17.2,60.2 17.2,49.2 v18.4,48 R1.2 | U4.34 17.75,19.55 v18.2,20
  Bottom 0.25: v18.2,20 18.2,37 18.4,37.2 v18.4,48
CODEC_CLKOUT
  Top 0.25: U2.6 20,72 19.2,71.2 19.2,69.2 14.88,64.88 0.1
CODEC_DACDAT  (via drill 0.33)
  Top 0.25: U2.8 20.89,70.69 20.4,70.2 20.4,61.6 v19.6,60.8 | U4.57 24.85,24.25 v24.6,24
  Bottom 0.25: v24.6,24 23.6,24 21.2,26.4 21.2,34.4 22.4,35.6 22.4,36.8 21.2,38 21.2,59.2 v19.6,60.8
CODEC_DACLRC  (via drill 0.33)
  Top 0.25: U2.9 22,70 21,69 21,60 v19.4,58.4 | U4.20 16.35,26.25 v16.8,25.8 | R19.2 v14.6,17.6
  Bottom 0.25: v14.6,17.6 14.6,23.6 v16.8,25.8 15.8,26.8 15.8,54.8 v19.4,58.4
CODEC_DBVDD
  Top 0.25: U2.5 17.3,72.5 C21.2 C24.2 FB3.1
CODEC_DCVDD
  Top 0.25: U2.3 17.3,73.5 C23.2 C22.2 FB2.1
CODEC_HPVDD
  Top 0.25: U2.12 23.5,68.3 C25.2 C26.2 FB4.2
CODEC_MCLK_IN
  Top 0.25: U2.1 19.9,74.5 19.2,75.2 19.2,77.6 R40.2 R18.2 C15.2 | C15.2 17.8,86.2 X3.1 | C15.2 R23.1
CODEC_SCLK  (via drill 0.33)
  Top 0.25: U2.28 20.68,75.31 v20.6,75.4 | U4.61 28.35,26.25 v28.6,26 | v32.6,35 R46.1
  Bottom 0.25: v20.6,75.4 20.6,61.8 22.4,60 22.4,48.4 32.6,38.2 v32.6,35 32.6,28.6 30,26 v28.6,26
CODEC_SDI  (via drill 0.33)
  Top 0.25: U2.27 22,75.8 v21.4,76.4 | U4.62 29.55,26.75 v30.2,27.4 | v31,35 R47.1
  Bottom 0.25: v21.4,76.4 20.4,76.4 19.8,75.8 19.8,61.8 21.8,59.8 21.8,48.2 31,39 v31,35 31,28.2 v30.2,27.4
GND  (via drill 0.33)
  Top 0.25: U4.12 19.25,28.55 v19.6,28.2 | U4.63 25.45,27.25 v25.2,27 | U4.18 16.65,27.25 v16.8,27.4
  other vias: 30.6,70.2 29,70.2 29,77 30.6,77 26.4,68 26.4,66.4 15.4,69.6 17,69.6 17,76.4 15.4,76.4 49.8,87.8 49.8,82.2 49.8,84 49.8,86 62.6,87 61.2,88.8 62.6,90.4 62.6,70.4 62.6,67 61.2,68.8 62.6,47 62.6,50.4 61.2,48.8 50,47.2 50,42.8 49,43.8 49,46.2 48,47.2 48,42.8 49.8,67 49.8,63 48.8,64 48.8,66 29.6,79.6 29.6,78 29.2,31.8 29.6,29.6 27.8,16.4 27.6,14.6 26.4,13.4 13.4,17.2 11.6,17.4 10.4,18.6 12.4,28.8 13.4,29.8 56.2,12.2 55,13.2 56.2,13.6 11.4,81.2 19.4,81.2 47.4,24.6 49.4,24.4 52.6,19.4 58.8,19.4 62,19.4 63.4,19.4 62.8,35 62,33.4 49.6,31.4 48.4,32.6 32.8,13.6 44,16.2 44,17.4 42,20.8 17.4,37.8 17.4,45.8 23.8,40.2 31.8,40.2 19.8,32 33.6,54 24.8,54 50.8,5.6 49.6,5.6 17.6,11 17.6,9 18.6,10 13,11 10,12.6 9,11.6 4.4,61.6 7.4,61.6 7.4,58.6 4.4,58.6
  pour Top (rank 2, no thermals): 65,95 65,0 0,0 0,95
  pour Route2 (no thermals): 0,0 0,95 65,95 65,0
HEADPHONE_OUT_L
  Top 0.3: J3.2 49.1,48.7 R17.1 47.8,50 C13.2
HEADPHONE_OUT_R
  Top 0.3: J3.3 49.1,41.3 R16.2 47.8,40 C14.2
LINE_IN_L
  Top 0.3: J5.2 50.1,88.7 R8.1
LINE_IN_R
  Top 0.3: J5.3 50.1,81.3 R9.1
LINE_OUT_L
  Top 0.3: R14.1 52.9,69 J4.2
LINE_OUT_R
  Top 0.3: R15.1 60.3,61 J4.3
MCU_BOOT0
  Top 0.25: U4.60 27.65,25.75 28.2,25.2 29.2,25.2 30.8,26.8 R32.1
MCU_BOOT1
  Top 0.25: U4.28 9.35,22.25 R33.2
MCU_I2S2_MCK  (via drill 0.33)
  Top 0.25: v15,79 R40.1 | U4.37 19.25,17.25 17,15 12,15 v11,16
  Bottom 0.25: v15,79 12.6,79 9.6,76 9.6,17.4 v11,16
MCU_I2S3_MCK  (via drill 0.33)
  Top 0.25: v15,80.6 R18.1 | U4.38 19.75,16.95 17.2,14.4 v9,14.4
  Bottom 0.25: v15,80.6 13.4,80.6 9,76.2 v9,14.4
MCU_JTCK/SWCLK
  Top 0.25: U4.49 27.35,20.25 32.4,15.2 R27.2
MCU_JTDI
  Top 0.25: U4.50 32.55,20.75 33,21.2 33.4,21.2 R29.2
MCU_JTDO/TRACESWO  (via drill 0.33)
  Top 0.25: v29.6,16.8 26.8,19.6 25.8,19.6 25.2,20.2 v25.2,22.8 25.65,23.25 U4.55 | v32,16.8 R28.2 | v16.6,62.4 R2.1
  Bottom 0.25: v29.6,16.8 v32,16.8 | v25.2,22.8 24,22.8 20.6,26.2 20.6,34.6 21.8,35.8 21.8,36.6 20.6,37.8 20.6,58.4 v16.6,62.4
MCU_JTMS/SWDIO
  Top 0.25: U4.46 23.75,13.45 24.6,12.6 36.6,12.6 R26.2
MCU_OSC32_IN
  Top 0.25: R31.2 26.8,35.8 24.8,35.8 23.75,34.75 U4.3
MCU_OSC32_OUT
  Top 0.25: U4.4 23.25,35.25 24.6,36.6 R3.2
MCU_OSC_IN
  Top 0.25: U4.5 22.75,40.45 19.2,44 18.6,44 C3.2 14.4,44.2 X2.1 14.88,46.8 0.2
MCU_OSC_OUT
  Top 0.25: U4.6 22.25,39.35 19.2,42.4 18.6,42.4 R5.2
MCU_RESET#  (via drill 0.33)
  Top 0.25: U4.7 21.75,28.25 v22,28 | v34.2,23.4 R30.2 | C29.2 SW1.4 SW1.3 24.8,45.8 v23,44
  Bottom 0.25: v34.2,23.4 26.6,23.4 v22,28 22,34 23,35 v23,44
MCU_SDIO_CK  (via drill 0.33)
  Top 0.25: U4.53 28.85,22.25 v29.2,22.6 | v50.4,25.6 J6.5
  Bottom 0.25: v29.2,22.6 40.2,22.6 43.2,25.6 v50.4,25.6
MCU_SDIO_CMD  (via drill 0.33)
  Top 0.25: v50.4,27.8 J6.3 R36.1 | U4.54 28.15,22.75 v29.6,24.2
  Bottom 0.25: v29.6,24.2 41,24.2 44.6,27.8 v50.4,27.8
MCU_SDIO_D0  (via drill 0.33)
  Top 0.25: v50.4,23.4 J6.7 46.8,23.4 R35.1 | U4.39 20.25,21.15 v19.8,21.6
  Bottom 0.25: v19.8,21.6 40,21.6 41.8,23.4 v50.4,23.4
MCU_SDIO_D1  (via drill 0.33)
  Top 0.25: v49.8,22.4 49.7,22.3 J6.8 47.3,22.3 R34.1 | U4.40 20.75,20.35 v21.2,20.8
  Bottom 0.25: v21.2,20.8 40.6,20.8 42.2,22.4 v49.8,22.4
MCU_SDIO_D2  (via drill 0.33)
  Top 0.25: U4.51 30.25,21.25 v34.8,25.8 | v50.4,30 J6.1 47.4,30 R38.1 | v24,48 R1.1
  Bottom 0.25: v50.4,30 45.2,30 41,25.8 v34.8,25.8 34,26.6 34,40 26,48 v24,48
MCU_SDIO_D3  (via drill 0.33)
  Top 0.25: U4.52 29.55,21.75 v32.8,25 | v49.8,29 49.7,28.9 J6.2 46.9,28.9 R37.1
  Bottom 0.25: v32.8,25 41,25 45,29 v49.8,29
MCU_USB_DM
  Top 0.25: R41.1 52.4,8.8 52,9.2 25.8,9.2 22.75,12.25 U4.44
MCU_USB_DP
  Top 0.25: R4.1 52.4,10.4 52,10 26,10 23.25,12.75 U4.45
MCU_USB_ID  (via drill 0.33)
  Top 0.25: U4.43 22.25,19.35 v21.8,19.8 | v26.4,11.4 27,12 R42.1
  Bottom 0.25: v26.4,11.4 21.8,16 v21.8,19.8
MCU_USB_VBUS
  Top 0.25: FB6.2 24.8,7.2 21.75,10.25 U4.42
  Top 0.5: FB6.2 C27.2
MCU_VBAT  (via drill 0.33)
  Top 0.25: U4.1 24.75,31.05 v24.6,31.2 R24.2 | 13,53 13.2,53 13.6,52.6 13.6,52 14.25,51.35 15.65,51.35 16.4,50.6 16.4,48.6 18.2,46.8 19.2,46.8 19.6,46.4 19.6,45.4 23,42 v24,42
  Top 0.5: BAT1.POS@2 11.97,68.03 13,67 13,53 11.97,51.98 BAT1.POS@1
  Bottom 0.25: v24.6,31.2 24.6,39.6 25,40 25,41 v24,42
MCU_VDD  (via drill 0.33)
  Top 0.25: U4.64 28.35,27.75 C43.2 | U4.48 24.75,16.85 C42.2 | U4.32 13.85,20.25 C37.2 | U4.19 13.85,26.75 C36.2 13.06,27.54 J8.1 | v49.8,26.8 49.7,26.7 J6.4 46.9,26.7 C28.2 | 31,31 R47.2 | 32.6,31 R46.2 | J7.1 41.54,30.94 41.6,31 | R24.1 25.8,34 FB9.2
  Top 0.5: FB9.2 26.2,31.9 C35.2 | R35.2 R34.2 | R20.2 41.8,14.63 J2.1 40.34,14.86 40,15.2 40,22.6 40.4,23 R35.2 | R25.2 R22.2 v30.6,18.4 | 27,30.6 29.4,30.6 29.8,31 31,31 32.6,31 41.6,31 R38.2 R37.2 R36.2 44.8,26.2 | R35.2 44.8,26.2 | 44.8,26.2 C28.2
  Bottom 0.5: v26.6,18.4 v30.6,18.4
  pour Top (no thermals): 27,32.4 27,18 15,18 15,30 25.6,30 25.6,32.4
MCU_VDDA
  Top 0.25: U4.13 18.75,32.65 C34.2
  Top 0.5: C34.2 C38.2 FB7.2
MIC_IN
  Top 0.25: C10.2 R11.1 | C10.2 R10.2 | C9.1 25.5,78.5 25.8,78.2 26.8,78.2 C10.2
N$1
  Top 0.25: C2.2 X1.1 26.53,37.13 R3.1
N$2
  Top 0.25: R29.1 R25.1 35.6,20 36.93,18.67 J2.8
N$3
  Top 0.25: R22.1 R28.1 35.8,17.2 36,17.2 36.2,17.4 J2.6
N$4
  Top 0.25: R21.2 R27.1 36.33,16.13 J2.4
N$5
  Top 0.25: R20.1 R26.1 38.6,14.8 38.54,14.86 J2.2
N$6
  Top 0.25: J1.3 55.4,10 R4.2
N$7
  Top 0.25: C1.2 X1.2 29.07,37.13 R31.1
N$8
  Top 0.25: J2.10 37.06,19.94 37,20 R30.1
N$9
  Top 0.25: R32.2 J7.2
N$10
  Top 0.25: X2.2 14.4,39.4 C4.2 R5.1
N$11
  Top 0.25: J1.2 55.4,9.2 R41.2
N$14
  Top 0.25: J8.2 R33.1
N$15
  Top 0.25: U2.2 19.6,74 18.6,75 18.6,76.8 17.4,78 13.4,78 13,78.4 C16.2 | C16.2 13,86.2 X3.2 | C16.2 R23.2
N$16
  Top 0.25: U4.47 24.25,15.05 C40.1
N$18
  Top 0.25: U2.24 23.5,79.7 31.8,88 C6.1
N$19
  Top 0.25: U2.23 24,79.4 26.6,82 C5.1
N$20
  Top 0.3: C8.1 R9.2 | C8.1 R7.1 | C5.2 C8.1
N$21
  Top 0.3: C7.2 R8.2 | C7.2 R6.2 | C6.2 C7.2
N$22
  Top 0.25: R39.2 47.2,19.8 48,20.6 48,21.35 J6.CARD_DETECT
N$23
  Top 0.25: U4.31 12.05,20.75 C41.2
N$24
  Top 0.25: U2.21 26.7,74.5 R11.2
N$25
  Top 0.25: U2.22 24.5,76 C9.2
N$27  (via drill 0.33)
  Top 0.25: U2.16 26.4,72 v26.8,71.6 | C11.1 38.75,70.25 v38,71
  Bottom 0.25: v26.8,71.6 26.8,73 27.2,73.4 35.6,73.4 v38,71
N$28  (via drill 0.33)
  Top 0.25: U2.17 27.5,72.5 v27.6,72.4 | C12.1 38.75,62.25 v38,63
  Bottom 0.25: v27.6,72.4 34.6,72.4 38,69 v38,63
N$29
  Top 0.3: C11.2 R14.2 R12.1
N$30
  Top 0.3: C12.2 R15.2 R13.2
N$33
  Top 0.25: U2.13 24,70.2 24.4,69.8 26.2,69.8 32.4,63.6 32.4,59.8 38.85,53.35 C13.1
N$34
  Top 0.25: C14.1 38.85,41.45 42,44.6 42,51 33,60 33,64 26.6,70.4 24.6,70.4 24.5,70.5 U2.14
N$41
  Top 0.25: C18.2 C17.2 28.6,74 U2.20
SDIO_CARD_DETECT  (via drill 0.33)
  Top 0.25: U4.41 21.25,17.05 v20.6,16.4 | R39.1 45,19.6 v45,13
  Bottom 0.25: v20.6,16.4 20.6,15.4 26,10 42,10 v45,13
USB_ID
  Top 0.25: J1.4 56.2,10.8 R42.2
USB_SHIELD  (1 unrouted)
  Top 0.5: 58.6,14.2 J1.SHIELD@4 58.1,14.7 56.4,16.4 FB5.2 C31.2 | 58.6,14.2 J1.SHIELD@3 | J1.SHIELD@2 J1.SHIELD@1 | 58.6,14.2 58.8,14.4
USB_VBUS
  Top 0.5: J1.1 56.6,8.4 55.6,7.4 55.2,7.4 FB6.1 55,5.2 54.2,4.4 20.65,4.4 D1.A
V+
  Top 0.5: 11.65,7.6 D2.C D1.C 14.35,7.4 U3.1 15.95,10.05 C30.2 15.8,10.2 15.8,11.6 15.45,11.95 U3.3
VBAT
  Top 0.5: J9.1 5,8.95 D2.A

### Text on the board
tDocu: LINE IN | LINE OUT | HEADPHONE